# Altium schematic sheet misc_connectors.SchDoc
size A4; SheetNumber: 9; SheetTotal: 10
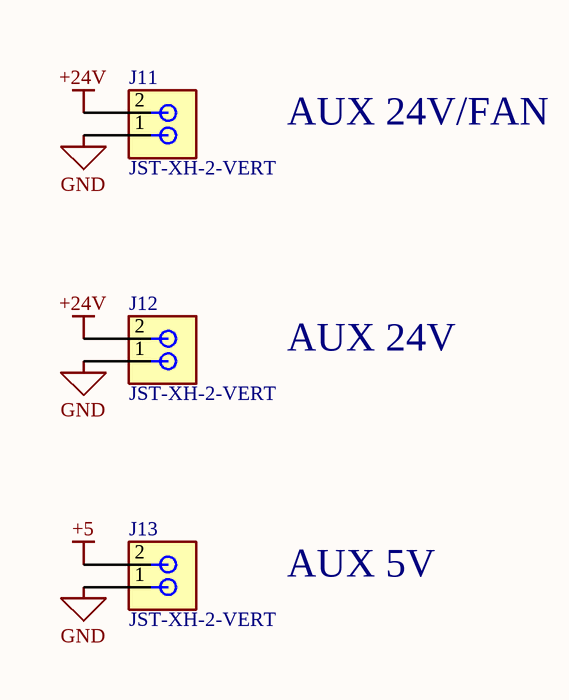
[diagram p0: misc_connectors.SchDoc]

## Parts
J11  JST-XH-2-VERT  [JST-XH-2p-vert]
J12  JST-XH-2-VERT  [JST-XH-2p-vert]
J13  JST-XH-2-VERT  [JST-XH-2p-vert]

## Nets
+5: J13.2
+24V: J11.2 J12.2
GND: J11.1 J12.1 J13.1

## Notes on the sheet
- AUX 24V/FAN
- AUX 24V
- AUX 5V

## Library data of the parts
J11-J13 = JST-XH-2-VERT: Konektor: kabel-pl.spoj; zásuvka; vidlice; PIN: 2; XH; 3A; 250V; THT; Basic: No; TME Part: B2B-XH-A